# EAGLE design StickIt (EAGLE 5.11)
AUTHOR: Dave Vandenbout / XESS Corp.; COPYRIGHT: c 2012 XESS Corp.; DIGIKEY#: S5520-ND; MANF: Good Luck Buy; MANF#: 69481; MOUSER#: 653-B3F-1000; VERSION#: 3.0
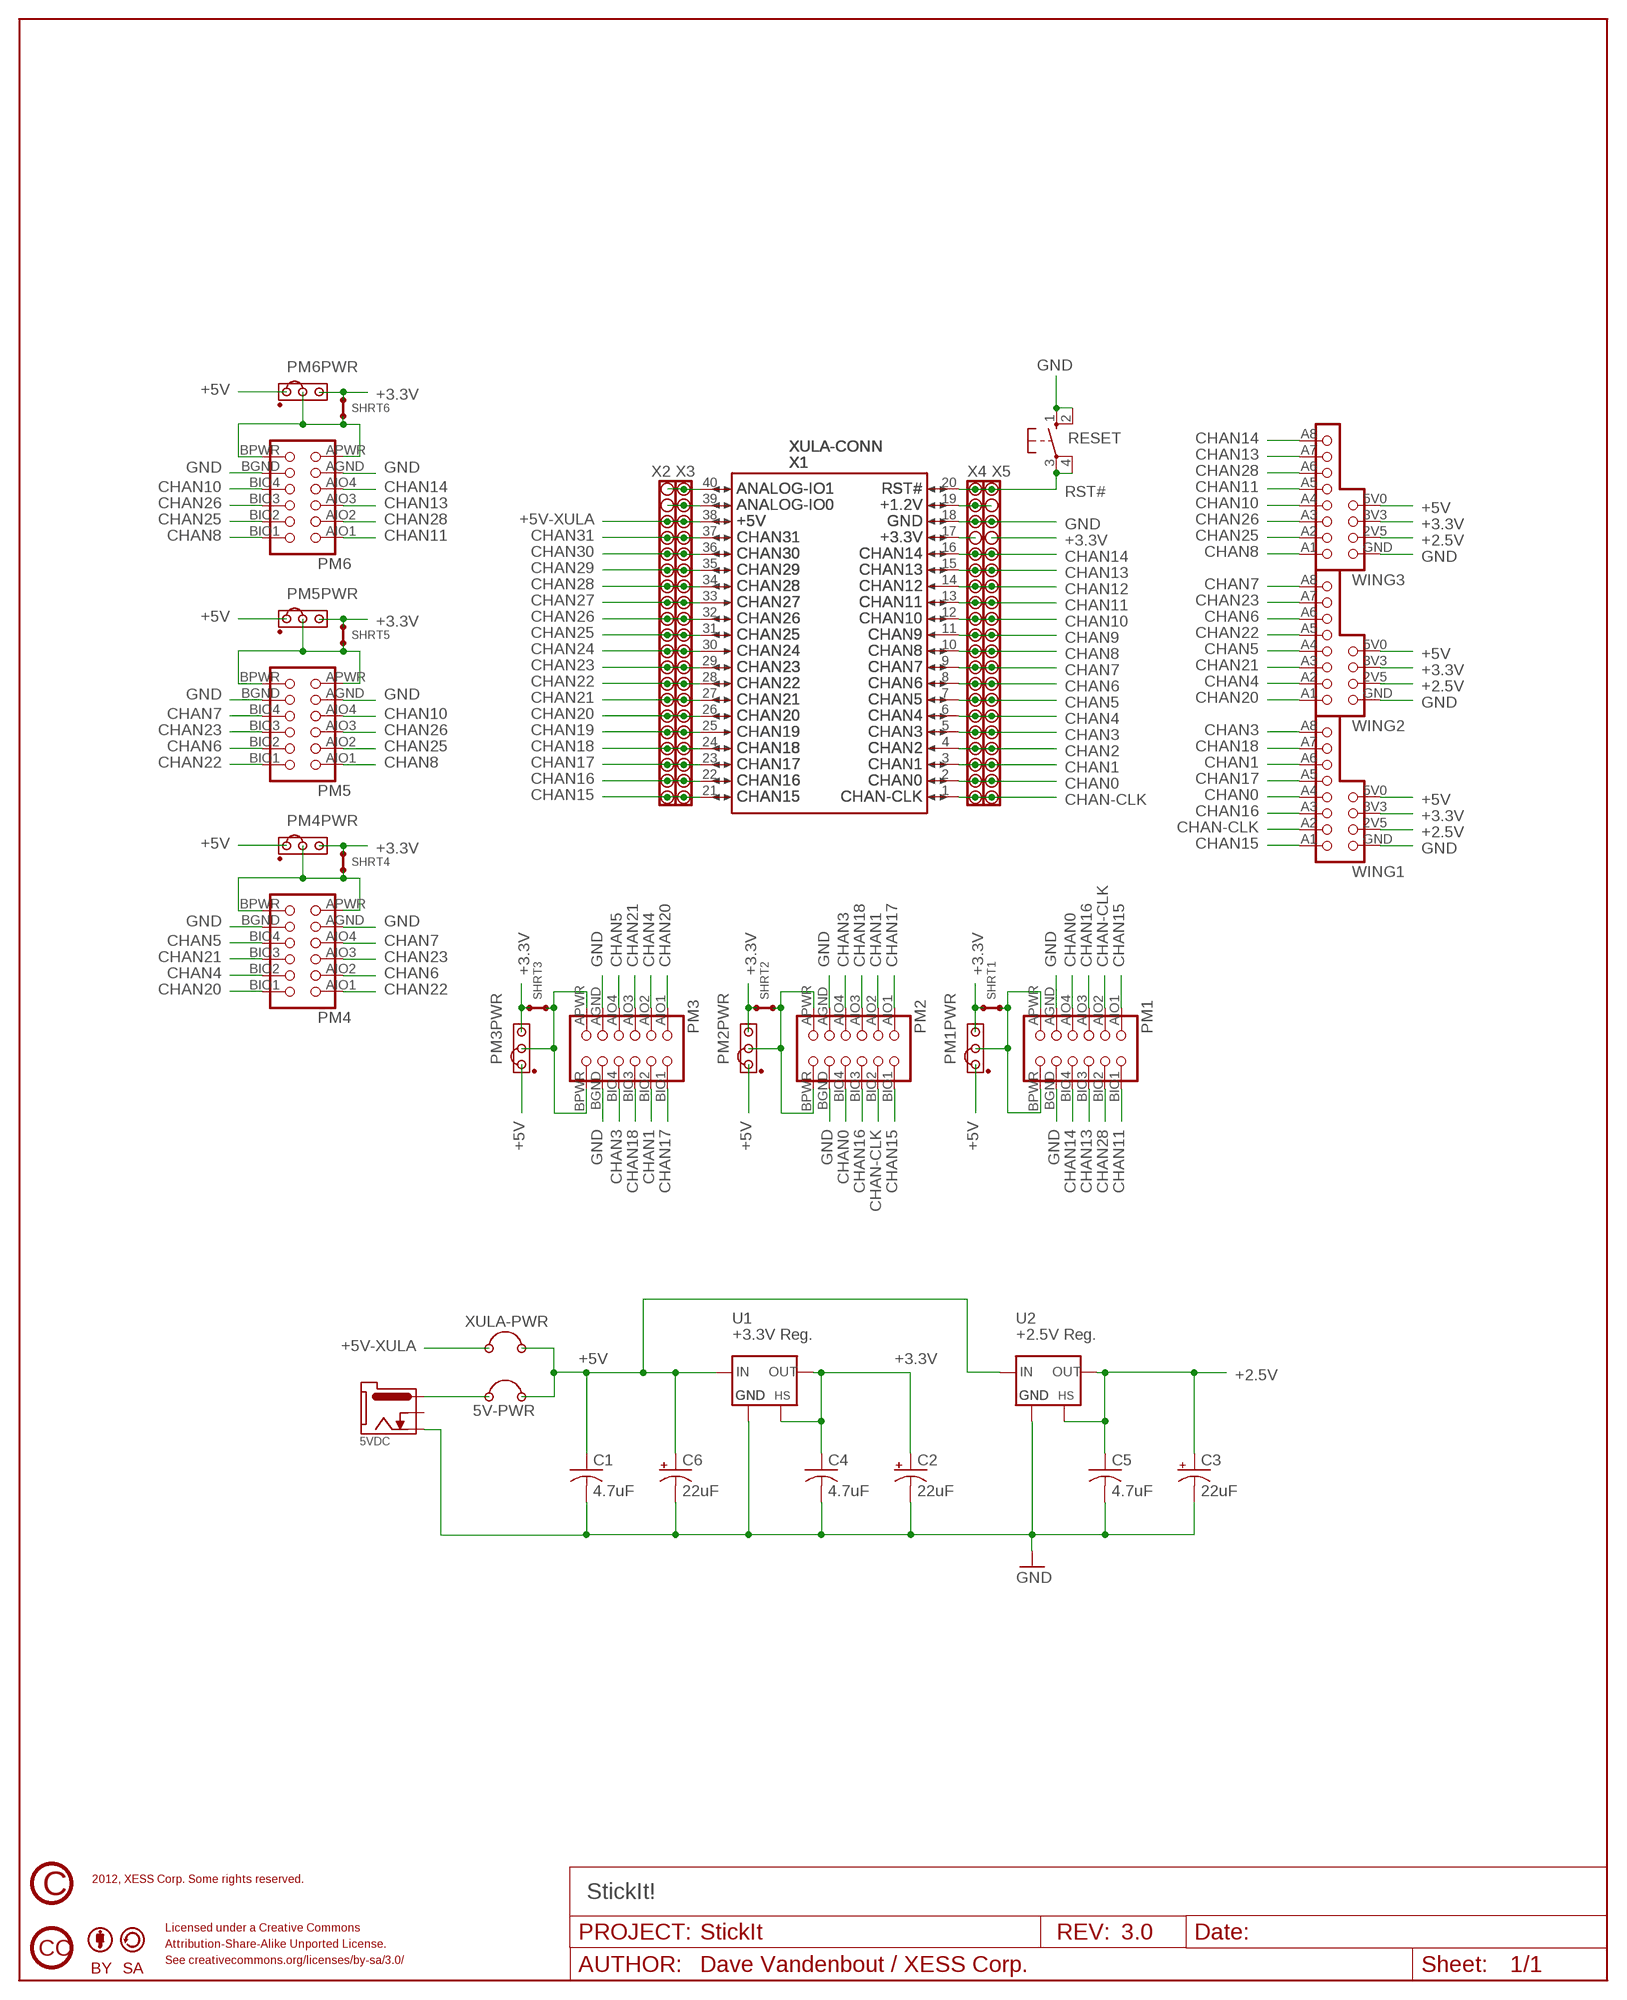
[diagram p0: schematic, sheet 1]

## Parts
5V-PWR  JP1Q"  [JP1]
5VDC  POWERJACKRIGHT_ANGLE  [PJ-202]
C1  4.7uF  C-USC0603  [C0603]
C2  22uF  CPOL-USC  [PANASONIC_C]
C3  22uF  CPOL-USC  [PANASONIC_C]
C4  4.7uF  C-USC0603  [C0603]
C5  4.7uF  C-USC0603  [C0603]
C6  22uF  CPOL-USC  [PANASONIC_C]
PM1  PMOD12SOCKET  [PMOD12-SOCKET]
PM1PWR  JP2E  [JP2]
PM2  PMOD12SOCKET  [PMOD12-SOCKET]
PM2PWR  JP2E  [JP2]
PM3  PMOD12SOCKET  [PMOD12-SOCKET]
PM3PWR  JP2E  [JP2]
PM4  PMOD12SOCKET  [PMOD12-SOCKET]
PM4PWR  JP2E  [JP2]
PM5  PMOD12SOCKET  [PMOD12-SOCKET]
PM5PWR  JP2E  [JP2]
PM6  PMOD12SOCKET  [PMOD12-SOCKET]
PM6PWR  JP2E  [JP2]
RESET  10-XX  [B3F-10XX]
SHRT1  JSHORTWIDE  [JPSHORTW]
SHRT2  JSHORTWIDE  [JPSHORTW]
SHRT3  JSHORTWIDE  [JPSHORTW]
SHRT4  JSHORTWIDE  [JPSHORTW]
SHRT5  JSHORTWIDE  [JPSHORTW]
SHRT6  JSHORTWIDE  [JPSHORTW]
U1  +3.3V Reg.  FAN1117  [SOT223]
U2  +2.5V Reg.  FAN1117  [SOT223]
U$2  CC_CC  [CC_CC]
U$3  CC_BY  [CC_BY]
U$4  CC_SA  [CC_SA]
U$5  CC_COPYRIGHT  [CC_COPYRIGHT]
WING1  PAPILIO_WING8SOCKET  [PAPILIO_WING8]
WING2  PAPILIO_WING8SOCKET  [PAPILIO_WING8]
WING3  PAPILIO_WING8SOCKET  [PAPILIO_WING8]
X1  XULA-CONN  [XULA-DIP40]
X2  PINHD-1X20A  [1X20]
X3  PINHD-1X20A  [1X20]
X4  PINHD-1X20A  [1X20]
X5  PINHD-1X20A  [1X20]
XULA-PWR  JP1Q"  [JP1]

## Nets
+2.5V: C3.+ C5.1 U2.2(OUT) U2.4(HS) WING1.2V5 WING2.2V5 WING3.2V5
+3.3V: C2.+ C4.1 PM1PWR.3 PM2PWR.3 PM3PWR.3 PM4PWR.3 PM5PWR.3 PM6PWR.3 SHRT1.2 SHRT2.2 SHRT3.2 SHRT4.2 SHRT5.2 SHRT6.2 U1.2(OUT) U1.4(HS) WING1.3V3 WING2.3V3 WING3.3V3 X5.4
+5V: 5V-PWR.2 C1.1 C6.+ PM1PWR.1 PM2PWR.1 PM3PWR.1 PM4PWR.1 PM5PWR.1 PM6PWR.1 U1.3(IN) U2.3(IN) WING1.5V0(5V) WING2.5V0(5V) WING3.5V0(5V) XULA-PWR.2
+5V-XULA: X1.38 X2.3 X3.3 XULA-PWR.1
CHAN0: PM1.AIO4 PM2.BIO4 WING1.A4 X1.2 X4.19 X5.19
CHAN1: PM2.AIO2 PM3.BIO2 WING1.A6 X1.3 X4.18 X5.18
CHAN2: X1.4 X4.17 X5.17
CHAN3: PM2.AIO4 PM3.BIO4 WING1.A8 X1.5 X4.16 X5.16
CHAN4: PM3.AIO2 PM4.BIO2 WING2.A2 X1.6 X4.15 X5.15
CHAN5: PM3.AIO4 PM4.BIO4 WING2.A4 X1.7 X4.14 X5.14
CHAN6: PM4.AIO2 PM5.BIO2 WING2.A6 X1.8 X4.13 X5.13
CHAN7: PM4.AIO4 PM5.BIO4 WING2.A8 X1.9 X4.12 X5.12
CHAN8: PM5.AIO1 PM6.BIO1 WING3.A1 X1.10 X4.11 X5.11
CHAN9: X1.11 X4.10 X5.10
CHAN10: PM5.AIO4 PM6.BIO4 WING3.A4 X1.12 X4.9 X5.9
CHAN11: PM1.BIO1 PM6.AIO1 WING3.A5 X1.13 X4.8 X5.8
CHAN12: X1.14 X4.7 X5.7
CHAN13: PM1.BIO3 PM6.AIO3 WING3.A7 X1.15 X4.6 X5.6
CHAN14: PM1.BIO4 PM6.AIO4 WING3.A8 X1.16 X4.5 X5.5
CHAN15: PM1.AIO1 PM2.BIO1 WING1.A1 X1.21 X2.20 X3.20
CHAN16: PM1.AIO3 PM2.BIO3 WING1.A3 X1.22 X2.19 X3.19
CHAN17: PM2.AIO1 PM3.BIO1 WING1.A5 X1.23 X2.18 X3.18
CHAN18: PM2.AIO3 PM3.BIO3 WING1.A7 X1.24 X2.17 X3.17
CHAN19: X1.25 X2.16 X3.16
CHAN20: PM3.AIO1 PM4.BIO1 WING2.A1 X1.26 X2.15 X3.15
CHAN21: PM3.AIO3 PM4.BIO3 WING2.A3 X1.27 X2.14 X3.14
CHAN22: PM4.AIO1 PM5.BIO1 WING2.A5 X1.28 X2.13 X3.13
CHAN23: PM4.AIO3 PM5.BIO3 WING2.A7 X1.29 X2.12 X3.12
CHAN24: X1.30 X2.11 X3.11
CHAN25: PM5.AIO2 PM6.BIO2 WING3.A2 X1.31 X2.10 X3.10
CHAN26: PM5.AIO3 PM6.BIO3 WING3.A3 X1.32 X2.9 X3.9
CHAN27: X1.33 X2.8 X3.8
CHAN28: PM1.BIO2 PM6.AIO2 WING3.A6 X1.34 X2.7 X3.7
CHAN29: X1.35 X2.6 X3.6
CHAN30: X1.36 X2.5 X3.5
CHAN31: X1.37 X2.4 X3.4
CHAN-CLK: PM1.AIO2 PM2.BIO2 WING1.A2 X1.1 X4.20 X5.20
GND: 5VDC.2 C1.2 C2.- C3.- C4.2 C5.2 C6.- PM1.AGND PM1.BGND PM2.AGND PM2.BGND PM3.AGND PM3.BGND PM4.AGND PM4.BGND PM5.AGND PM5.BGND PM6.AGND PM6.BGND RESET.1(S) RESET.2(S1) U1.1(GND) U2.1(GND) WING1.GND WING2.GND WING3.GND X1.18 X4.3 X5.3
N$1: 5V-PWR.1 5VDC.1
N$3: PM1.APWR PM1.BPWR PM1PWR.2 SHRT1.1
N$4: PM2.APWR PM2.BPWR PM2PWR.2 SHRT2.1
N$5: PM3.APWR PM3.BPWR PM3PWR.2 SHRT3.1
N$6: PM4.APWR PM4.BPWR PM4PWR.2 SHRT4.1
N$7: PM5.APWR PM5.BPWR PM5PWR.2 SHRT5.1
N$8: PM6.APWR PM6.BPWR PM6PWR.2 SHRT6.1
N$9: X1.17 X4.4
N$10: X1.19 X4.2 X5.2
N$11: X1.39 X2.2 X3.2
N$12: X1.40 X2.1 X3.1
RST#: RESET.3(P) RESET.4(P1) X1.20 X4.1 X5.1
Unconnected: 5VDC.3

## Notes on the sheet
- 2012, XESS Corp. Some rights reserved.
- StickIt!
- Licensed under a Creative Commons
- Attribution-Share-Alike Unported License.
- See creativecommons.org/licenses/by-sa/3.0/

## Library data of the parts
5V-PWR XULA-PWR = xess:JP1Q: JUMPER
5VDC = xess:POWERJACK: 2.1mm AC Adapter Power Jack
C1 C4 C5 = rcl:C-US: CAPACITOR, American symbol
C2 C3 C6 = rcl:CPOL-US: POLARIZED CAPACITOR, American symbol
PM1-PM6 = xess:PMOD12: 12-Pin PMOD Socket/Header 8 data I/O pins, 2 GND, 2 PWR.; DIGIKEY#: S5520-ND; MANF: Ho Chien; MANF#: 2553-2X6G
PM1PWR PM2PWR PM3PWR PM4PWR PM5PWR PM6PWR = xess:JP2E: JUMPER
RESET = xess:10-XX: OMRON SWITCH; DIGIKEY#: SW400-ND; MANF: Omron Electronics; MANF#: B3F-1000; MOUSER#: 653-B3F-1000
SHRT1-SHRT6 = xess:JSHORT: Bridge
U1 U2 = xess:FAN1117: +3.3V Linear Regulator
U$2 = xess:CC_CC
U$3 = xess:CC_BY
U$4 = xess:CC_SA
U$5 = xess:CC_COPYRIGHT
WING1-WING3 = xess:PAPILIO_WING8: PIN HEADER
X1 = xess:XULA-CONN: XuLA Board Connector
X2-X5 = pinhead:PINHD-1X20A: PIN HEADER

## Net classes
1 power: clearance 0.254 mm

## Board
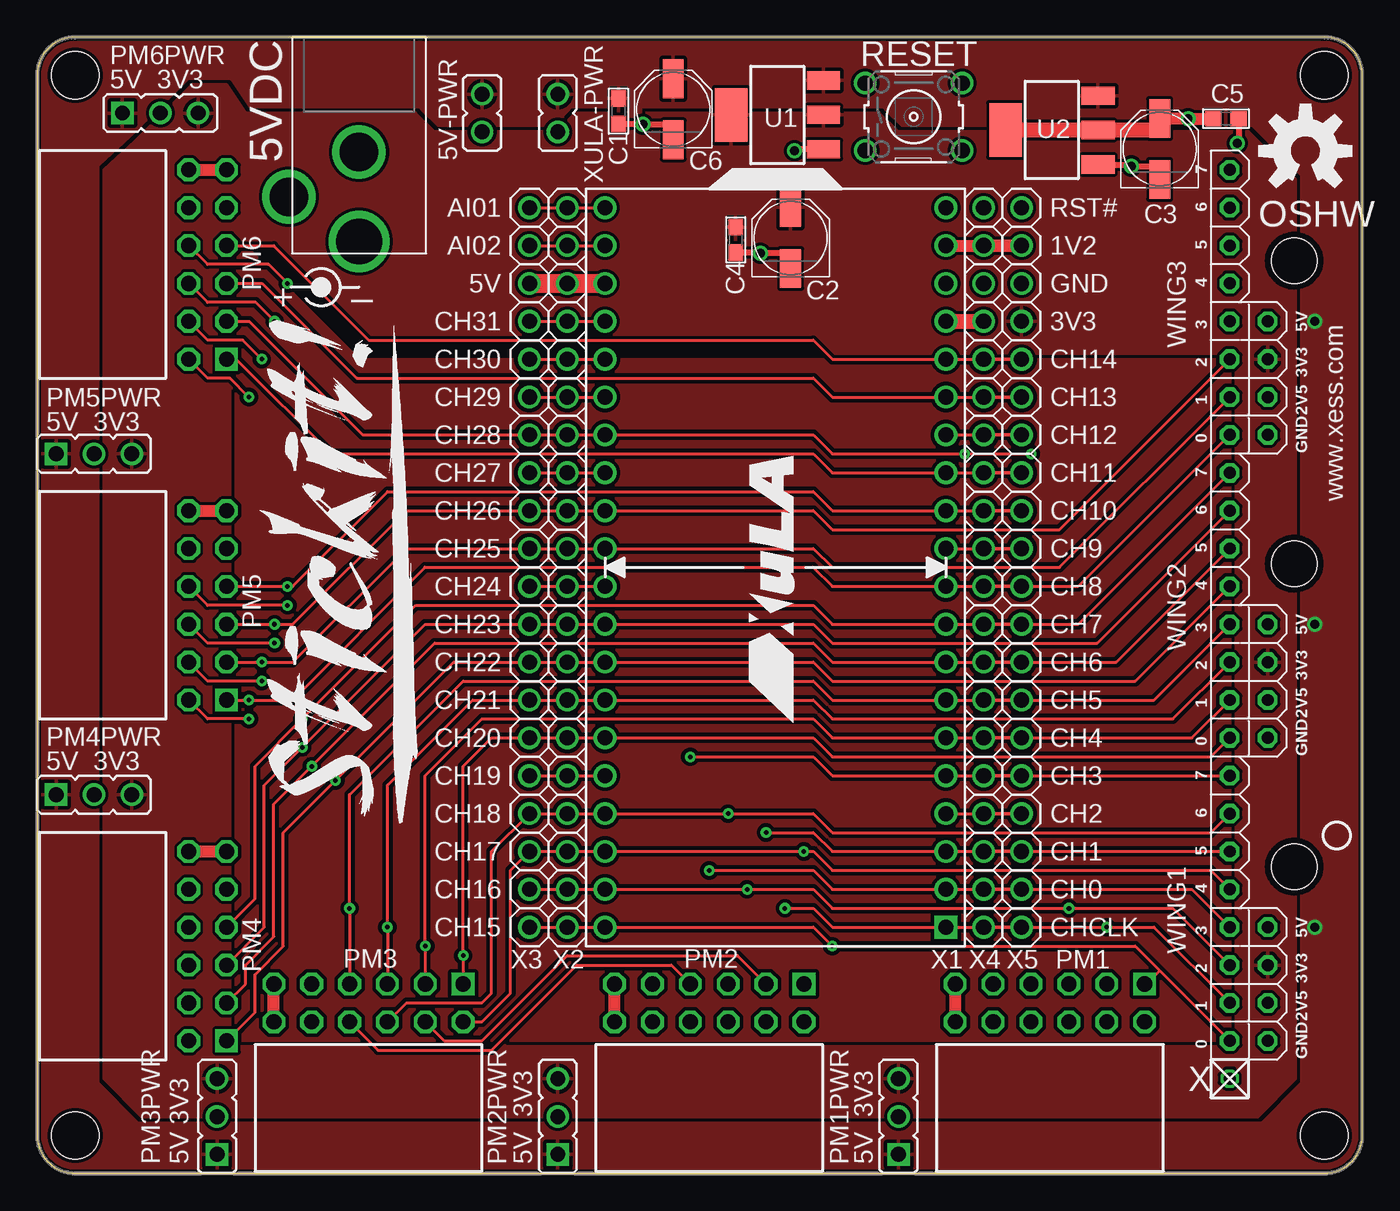
[diagram p1: board, top side]
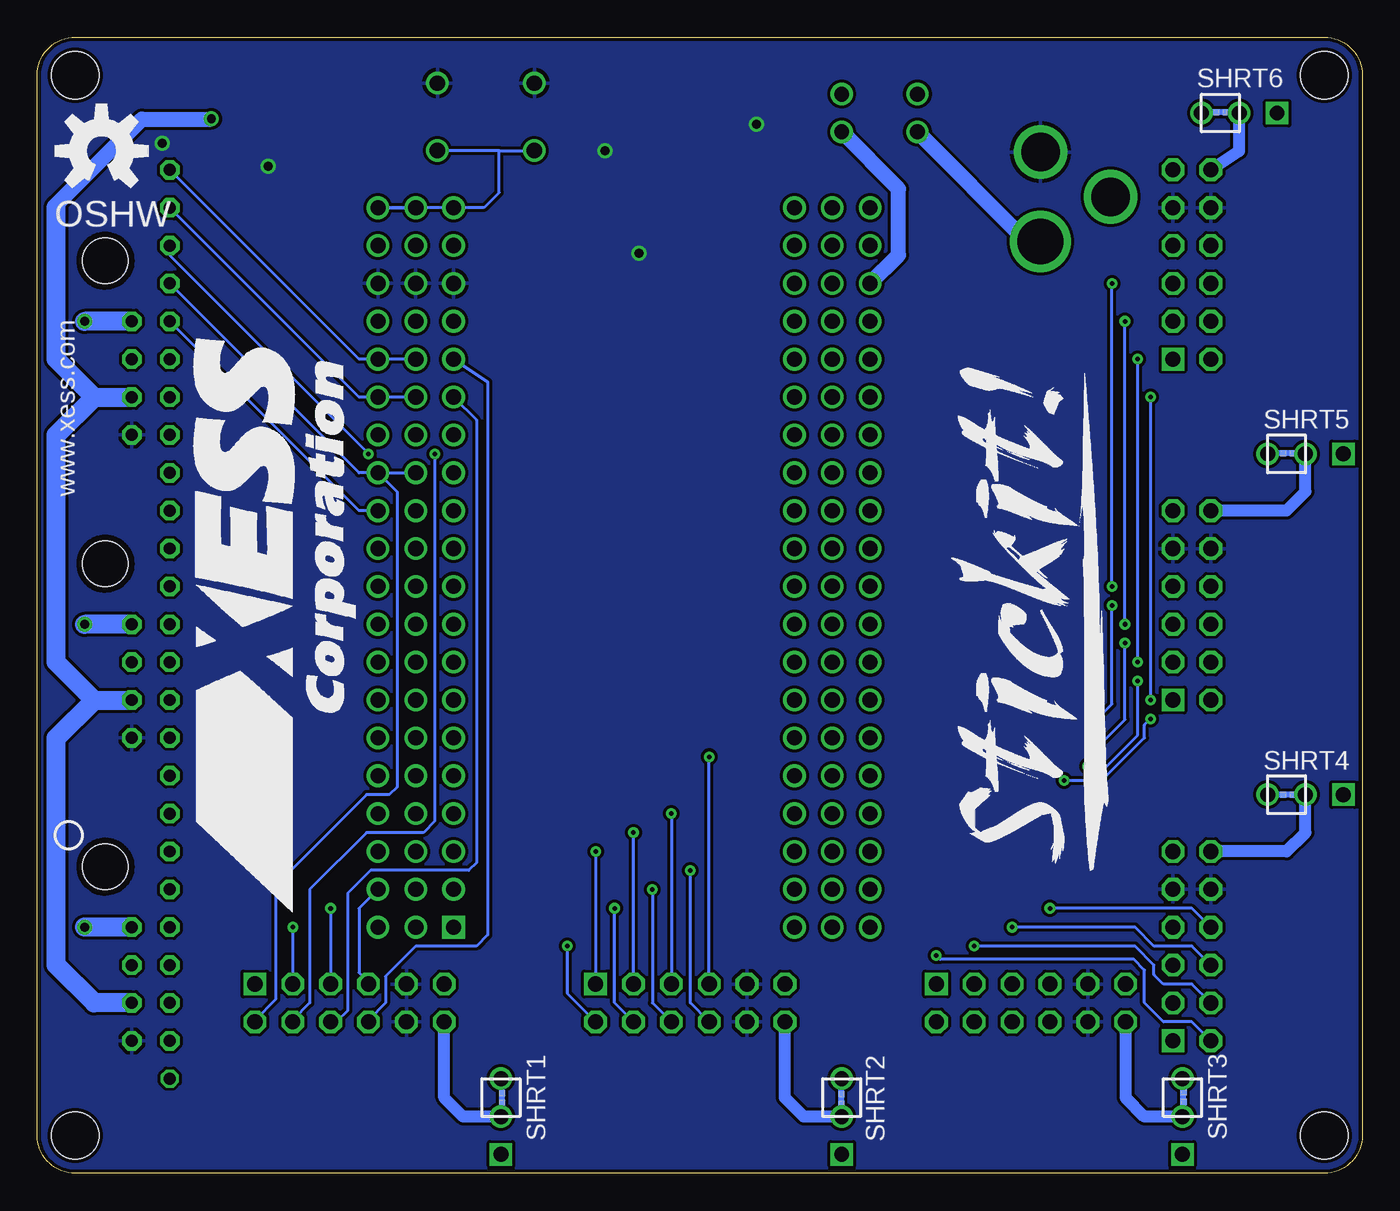
[diagram p2: board, bottom side, seen from below]

Size 88.9 x 76.2 mm. Coordinates in mm from the lower left corner, seen from the top.
Outline: 0,73.66 0,2.54 arc90 2.54,0 86.36,0 arc90 88.9,2.54 88.9,73.66 arc90 86.36,76.2 2.54,76.2 arc90 0,73.66
Copper layers (1*16): Top 0.035mm / dielectric 1.5mm / Bottom 0.035mm
Design rules "ITeadstudio_safe *": minimum track width 8mil, minimum drill 12mil, track to track 8mil, track to pad 8mil, pad to pad 8mil, via to via 8mil, smd to smd 0mil, copper to edge 10mil, drill to drill 10mil, minimum pad ring 10mil, minimum via ring 8mil, stop-mask expansion 2mil, vias tented up to drill 30mil, thermal gap 10mil
Holes 3.17 mm at 2.54,73.66 86.36,73.66 86.36,2.54 2.54,2.54

### Footprints (pad centres in the part's own frame; a part is rotated, then mirrored left to right if it is on the bottom)
JP1 = drill 1 round: 1 0,-1.27; 2 0,1.27
PJ-202 = drill 3.08 round: 1 13.7,0 | drill 2.58 round: 2 7.7,0; 3 10.7,-4.7
C0603 = smd 1.1 x 1: 1 -0.85,0; 2 0.85,0
PANASONIC_C = smd 2.6 x 1.4: + 2.05,0; - -2.05,0
PMOD12-SOCKET = drill 1.016 octagon: AGND 3.81,-1.27; AIO2 -3.81,-1.27; AIO3 -1.27,-1.27; AIO4 1.27,-1.27; APWR 6.35,-1.27; BGND 3.81,1.27; BIO1 -6.35,1.27; BIO2 -3.81,1.27; BIO3 -1.27,1.27; BIO4 1.27,1.27; BPWR 6.35,1.27 | drill 1.016 square: AIO1 -6.35,-1.27
JP2 = drill 1 square: 1 -2.54,0 | drill 1 round: 2 0,0; 3 2.54,0
B3F-10XX = drill 1.016 round: 1 -3.251,2.261; 2 3.251,2.261; 3 -3.251,-2.261; 4 3.251,-2.261
JPSHORTW = smd 0.406 x 0.406: 1 0,0; 2 0.635,0
SOT223 = smd 1.219 x 2.235: 1 -2.311,-3.099; 2 0,-3.099; 3 2.311,-3.099 | smd 3.6 x 2.2: 4 0,3.099
PAPILIO_WING8 = drill 0.8 octagon: 2V5 -2.54,-2.54; 3V3 -2.54,-5.08; 5V0 -2.54,-7.62; A1 0,0; A2 0,-2.54; A3 0,-5.08; A4 0,-7.62; A5 0,-10.16; A6 0,-12.7; A7 0,-15.24; A8 0,-17.78; GND -2.54,0 | hole 3.048: -4.318,-11.684
XULA-DIP40 = drill 1.016 square: 1 49.53,24.13 | drill 1.016 round: 2 46.99,24.13; 3 44.45,24.13; 4 41.91,24.13; 5 39.37,24.13; 6 36.83,24.13; 7 34.29,24.13; 8 31.75,24.13; 9 29.21,24.13; 10 26.67,24.13; 11 24.13,24.13; 12 21.59,24.13; 13 19.05,24.13; 14 16.51,24.13; 15 13.97,24.13; 16 11.43,24.13; 17 8.89,24.13; 18 6.35,24.13; 19 3.81,24.13; 20 1.27,24.13; 21 49.53,1.27; 22 46.99,1.27; 23 44.45,1.27; 24 41.91,1.27; 25 39.37,1.27; 26 36.83,1.27; 27 34.29,1.27; 28 31.75,1.27; 29 29.21,1.27; 30 26.67,1.27; 31 24.13,1.27; 32 21.59,1.27; 33 19.05,1.27; 34 16.51,1.27; 35 13.97,1.27; 36 11.43,1.27; 37 8.89,1.27; 38 6.35,1.27; 39 3.81,1.27; 40 1.27,1.27
1X20 = drill 1.016 round: 1 -24.13,0; 2 -21.59,0; 3 -19.05,0; 4 -16.51,0; 5 -13.97,0; 6 -11.43,0; 7 -8.89,0; 8 -6.35,0; 9 -3.81,0; 10 -1.27,0; 11 1.27,0; 12 3.81,0; 13 6.35,0; 14 8.89,0; 15 11.43,0; 16 13.97,0; 17 16.51,0; 18 19.05,0; 19 21.59,0; 20 24.13,0

### Placement (x,y rotation side)
5V-PWR  29.84,71.12 0 top
5VDC  21.59,76.2 270 top
C1  38.99,71.25 270 top
C2  50.55,62.74 90 top
C3  75.31,68.71 90 top
C4  46.86,62.61 270 top
C5  79.76,70.74 0 top
C6  42.67,71.37 90 top
PM1  67.94,11.43 180 top
PM1PWR  57.78,3.81 90 top
PM2  45.09,11.43 180 top
PM2PWR  34.92,3.81 90 top
PM3  22.23,11.43 180 top
PM3PWR  12.06,3.81 90 top
PM4  11.43,15.24 90 top
PM4PWR  3.81,25.4 0 top
PM5  11.43,38.1 90 top
PM5PWR  3.81,48.26 0 top
PM6  11.43,60.96 90 top
PM6PWR  8.26,71.12 0 top
RESET  58.8,70.87 0 top
SHRT1  57.71,4.72 90 bottom
SHRT2  34.95,4.67 90 bottom
SHRT3  11.99,4.8 90 bottom
SHRT4  4.67,25.4 180 bottom
SHRT5  4.67,48.29 180 bottom
SHRT6  9.14,71.17 180 bottom
U1  49.66,70.99 90 top
U2  68.07,69.98 90 top
U$2  15.24,-15.88 0 top  (outside the outline)
U$3  22.23,-14.61 0 top  (outside the outline)
U$4  27.3,-14.61 0 top  (outside the outline)
U$5  15.24,-6.99 0 top  (outside the outline)
WING1  80.01,8.89 180 top
WING2  80.01,29.21 180 top
WING3  80.01,49.53 180 top
X1  36.83,66.04 270 top
X2  35.56,40.64 270 top
X3  33.02,40.64 270 top
X4  63.5,40.64 270 top
X5  66.04,40.64 270 top
XULA-PWR  34.92,71.12 0 top

### Tracks (layer width: path | path; a pad name or v marks a point on that pad's centre or on a via)
+2.5V  (via drill 0.6)
  Top 0.406: 75.31,70.74 C3.+
  Top 0.813: 75.31,70.74 v77.22,70.74 C5.1
  Top 1.016: U2.4 U2.2 75.18,69.98 75.18,70.1 75.31,70.1 C3.+
  Bottom 0.813: 87.63,64.77 87.63,64.97 | 77.24,70.71 v77.22,70.74
  Bottom 1.016: 87.63,64.97 81.89,70.71 77.24,70.71
  Bottom 1.27: WING1.2V5 85.09,11.43 87.63,13.97 87.63,29.21 85.09,31.75 | 85.09,31.75 WING2.2V5 | 85.09,31.75 87.63,34.29 87.63,49.53 85.09,52.07 | 85.09,52.07 WING3.2V5 | 87.63,64.77 87.63,54.61 85.09,52.07
+3.3V
  Bottom 0.406: SHRT1.2 57.71,6.27 PM1PWR.3 | SHRT2.2 34.95,6.33 PM2PWR.3 | SHRT3.2 11.99,6.27 PM3PWR.3 | SHRT4.2 PM4PWR.3 | SHRT5.2 6.33,48.28 PM5PWR.3 | SHRT6.2 10.74,71.17 PM6PWR.3
  pour Top (rank 2): 6.99,3.81 78.11,3.81 81.28,3.81 81.92,3.81 84.45,6.35 84.45,66.67 81.28,69.85 57.78,69.85 56.52,71.12 36.07,71.12 34.8,69.85 26.67,69.85 25.4,71.12 13.97,71.12 12.7,73.03 10.36,73.03 6.55,69.22 4.45,67.31 4.45,6.35
+5V  (via drill 0.6)
  Bottom 1.27: WING3.5V0 v85.72,57.15 | WING2.5V0 v85.72,36.83 | WING1.5V0 v85.72,16.51
  pour Top (rank 3): 0,76.2 88.9,76.2 88.9,0 0,0
  pour Top (isolate 0.254, no thermals): 13.34,8.89 13.34,62.23 13.97,62.23 21.59,54.61 80.01,54.61 80.01,8.89
+5V-XULA
  Top 1.27: X1.38 X2.3 X3.3
  Bottom 1.016: X3.3 31.11,61.59 31.11,66.04 XULA-PWR.1
CHAN0  (via drill 0.3)
  Top 0.203: v45.09,20.32 52.07,20.32 53.34,19.05 X1.2 X5.19 X4.19 77.47,19.05 WING1.A4
  Bottom 0.203: PM2.BIO4 45.09,11.43 v45.09,20.32 | PM1.AIO4 66.67,12.83 67.31,13.46 67.31,17.78 X5.19
CHAN1  (via drill 0.3)
  Top 0.203: v48.9,22.86 52.07,22.86 53.34,21.59 X1.3 X5.18 X4.18 WING1.A6 | PM3.BIO2 27.3,8.89 29.84,8.89 35.56,14.61 46.99,14.61 PM2.AIO2
  Bottom 0.203: PM2.AIO2 v48.9,22.86
CHAN2
  Top 0.203: X1.4 X5.17 X4.17
CHAN3  (via drill 0.3)
  Top 0.203: v43.81,27.94 52.07,27.94 53.34,26.67 X1.5 X5.16 X4.16 WING1.A8 | PM3.BIO4 22.86,8.26 30.48,8.26 36.2,13.97 42.55,13.97 PM2.AIO4
  Bottom 0.203: PM2.AIO4 v43.81,27.94
CHAN4  (via drill 0.3)
  Top 0.203: PM3.AIO2 v26.04,15.24 26.04,26.67 29.84,30.48 52.07,30.48 53.34,29.21 X1.6 X5.15 X4.15 77.47,29.21 WING2.A2
  Bottom 0.203: PM4.BIO2 11.43,12.7 13.34,12.7 13.97,13.34 13.97,13.97 15.24,15.24 v26.04,15.24
CHAN5  (via drill 0.3)
  Top 0.203: PM3.AIO4 v20.95,17.78 20.95,25.4 28.57,33.02 52.07,33.02 53.34,31.75 X1.7 X5.14 X4.14 74.93,31.75 WING2.A4
  Bottom 0.203: PM4.BIO4 11.43,17.78 v20.95,17.78
CHAN6  (via drill 0.3)
  Top 0.203: v15.06,33.02 11.43,33.02 PM5.BIO2 | WING2.A6 72.39,34.29 X4.13 X5.13 X1.8 53.34,34.29 52.07,35.56 26.67,35.56 v18.41,27.3 15.88,24.77 15.88,15.88 13.97,13.97 13.97,12.7 PM4.AIO2
  Bottom 0.203: v15.06,33.02 15.06,29.39 17.14,27.3 v18.41,27.3
CHAN7  (via drill 0.3)
  Top 0.203: v16.79,38.1 11.43,38.1 PM5.BIO4 | WING2.A8 69.85,36.83 X4.12 X5.12 X1.9 53.34,36.83 52.07,38.1 25.4,38.1 v17.78,30.48 14.61,27.3 14.61,18.41 PM4.AIO4
  Bottom 0.203: v16.79,38.1 16.79,31.47 v17.78,30.48
CHAN8  (via drill 0.3)
  Top 0.203: PM5.AIO1 v14.2,31.75 17.14,31.75 26.01,40.66 52.05,40.66 53.34,39.37 X1.10 X5.11 X4.11 69.85,39.37 WING3.A1 | v14.2,52.07 12.93,53.34 11.43,53.34 PM6.BIO1
  Bottom 0.203: v14.2,31.75 v14.2,52.07
CHAN9
  Top 0.203: X1.11 X5.10 X4.10
CHAN10  (via drill 0.3)
  Top 0.203: PM5.AIO4 v16.79,39.37 17.14,39.37 23.5,45.72 52.07,45.72 53.34,44.45 X1.12 X5.9 X4.9 | v16.79,59.69 15.52,60.96 11.43,60.96 PM6.BIO4
  Bottom 0.203: v16.79,39.37 v16.79,59.69 | WING3.A4 67.31,44.45 X5.9
CHAN11
  Top 0.203: PM6.AIO1 13.36,54.61 19.71,48.26 52.07,48.26 53.34,46.99 X1.13 X5.8 X4.8
  Bottom 0.203: WING3.A5 67.31,46.99 X5.8 | X5.8 X4.8 | PM1.BIO1 74.3,10.29 72.9,11.68 72.9,19.3 66.8,25.4 65.28,25.4 64.77,25.91 64.77,45.72 X5.8
CHAN12
  Top 0.203: X1.14 X5.7 X4.7
CHAN13
  Top 0.203: X4.6 X5.6 X1.15 53.34,52.07 52.07,53.34 21.44,53.34 15.09,59.69 PM6.AIO3
  Bottom 0.203: WING3.A7 67.31,52.07 X4.6 | X1.15 59.44,50.55 59.44,20.83 59.94,20.32 66.55,20.32 68.07,18.8 68.07,10.92 68.83,10.16 PM1.BIO3
CHAN14
  Top 0.203: X4.5 X5.5 X1.16 53.34,54.61 52.07,55.88 22.23,55.88 15.88,62.23 PM6.AIO4
  Bottom 0.203: WING3.A8 67.31,54.61 X4.5 | PM1.BIO4 66.67,10.29 65.53,11.43 65.53,13.21 63.5,15.24 59.44,15.24 58.67,16 58.67,53.09 X1.16
CHAN15  (via drill 0.3)
  Top 0.203: X3.20 X2.20 X1.21 52.07,16.51 v53.34,15.24 73.66,15.24 75.31,13.59 | 75.31,13.59 WING1.A1 | PM1.AIO1 74.42,12.7 75.31,13.59
  Bottom 0.203: PM2.BIO1 53.34,12.06 v53.34,15.24
CHAN16  (via drill 0.3)
  Top 0.203: WING1.A3 76.2,17.78 v69.22,17.78 53.34,17.78 52.07,19.05 v47.62,19.05 X1.22 X2.19 X3.19
  Bottom 0.203: PM2.BIO3 47.62,11.43 v47.62,19.05 | v69.22,17.78 PM1.AIO3
CHAN17  (via drill 0.3)
  Top 0.203: WING1.A5 78.74,20.32 53.34,20.32 52.07,21.59 v51.44,21.59 X1.23 X2.18 X3.18 31.75,20.32 31.75,12.06 29.84,10.16 PM3.BIO1
  Bottom 0.203: v51.44,21.59 PM2.AIO1
CHAN18  (via drill 0.3)
  Top 0.203: WING1.A7 78.74,22.86 53.34,22.86 52.07,24.13 v46.35,24.13 X1.24 X2.17 X3.17 30.48,21.59 30.48,12.06 29.84,11.43 24.77,11.43 PM3.BIO3
  Bottom 0.203: v46.35,24.13 PM2.AIO3
CHAN19
  Top 0.203: X1.25 X2.16 X3.16
CHAN20  (via drill 0.3)
  Top 0.203: PM3.AIO1 v28.57,14.61 28.57,27.3 30.48,29.21 X3.15 X2.15 X1.26 52.07,29.21 53.34,27.94 78.74,27.94 WING2.A1
  Bottom 0.203: PM4.BIO1 11.43,10.16 13.34,10.16 14.61,11.43 14.61,13.64 15.32,14.35 28.32,14.35 v28.57,14.61
CHAN21  (via drill 0.3)
  Top 0.203: PM3.AIO3 v23.5,16.51 23.5,26.04 29.21,31.75 X3.14 X2.14 X1.27 52.07,31.75 53.34,30.48 76.2,30.48 WING2.A3
  Bottom 0.203: PM4.BIO3 11.43,15.24 13.97,15.24 15.24,16.51 v23.5,16.51
CHAN22  (via drill 0.3)
  Top 0.203: v14.2,30.48 11.43,30.48 PM5.BIO1 | WING2.A5 73.66,33.02 53.34,33.02 52.07,34.29 X1.28 X2.13 X3.13 27.94,34.29 v20,26.35 16.51,22.86 16.51,15.24 14.61,13.34 14.61,10.79 PM4.AIO1
  Bottom 0.203: v20,26.35 17.46,26.35 14.61,29.21 14.61,30.07 v14.2,30.48
CHAN23  (via drill 0.3)
  Top 0.203: v15.93,35.56 11.43,35.56 PM5.BIO3 | PM4.AIO3 15.24,16.51 15.24,26.04 v17.78,28.57 26.04,36.83 X3.12 X2.12 X1.29 52.07,36.83 53.34,35.56 71.12,35.56 WING2.A7
  Bottom 0.203: v15.93,35.56 15.93,30.43 v17.78,28.57
CHAN24
  Top 0.203: X3.11 X2.11 X1.30
CHAN25  (via drill 0.3)
  Top 0.203: PM5.AIO2 v15.06,34.29 17.14,34.29 24.77,41.91 X3.10 X2.10 X1.31 52.07,41.91 53.34,40.64 68.58,40.64 WING3.A2 | v15.06,54.61 13.79,55.88 11.43,55.88 PM6.BIO2
  Bottom 0.203: v15.06,34.29 v15.06,54.61
CHAN26  (via drill 0.3)
  Top 0.203: PM5.AIO3 v15.93,36.83 17.14,36.83 24.77,44.45 X3.9 X2.9 X1.32 52.07,44.45 53.34,43.18 68.58,43.18 WING3.A3 | v15.93,57.15 14.66,58.42 11.43,58.42 PM6.BIO3
  Bottom 0.203: v15.93,36.83 v15.93,57.15
CHAN27
  Top 0.203: X1.33 X2.8 X3.8
CHAN28  (via drill 0.3)
  Top 0.203: PM6.AIO2 14.22,57.15 21.84,49.53 X3.7 X2.7 X1.34 52.07,49.53 53.34,48.26 v62.23,48.26 v66.67,48.26
  Bottom 0.203: v66.67,48.26 80.01,61.59 WING3.A6 | PM1.BIO2 71.75,10.29 70.61,11.43 70.61,19.05 66.8,22.86 62.99,22.86 62.23,23.62 v62.23,48.26
CHAN29
  Top 0.203: X1.35 X2.6 X3.6
CHAN30
  Top 0.203: X3.5 X2.5 X1.36
CHAN31
  Top 0.203: X1.37 X2.4 X3.4
CHAN-CLK  (via drill 0.3)
  Top 0.203: WING1.A2 74.93,16.51 v71.75,16.51 X4.20 X5.20 X1.1 53.34,16.51 52.07,17.78 v50.16,17.78
  Bottom 0.203: v50.16,17.78 50.16,11.43 PM2.BIO2 | v71.75,16.51 PM1.AIO2
GND  (via drill 0.6)
  Top 0.406: C1.2 40.6,70.4 v40.64,70.36 42.42,70.36 42.67,70.1 C6.- | C4.2 48.48,61.76 v48.51,61.72 50.29,61.72 50.55,61.47 C2.- | U1.1 50.9,68.68 v50.8,68.58 | U2.1 73.3,67.67 v73.41,67.56 75.18,67.56 75.18,66.78 C3.- | C5.2 80.61,69.18 v80.52,69.09
  pour Bottom: 0,76.2 88.9,76.2 88.9,0 0,0
N$1
  Bottom 1.016: 5VDC.1 22.5,62.5 5V-PWR.1
N$2  (via drill 0.8)
  other vias: 80.01,6.35
N$3
  Top 0.813: PM1.BPWR PM1.APWR
  Bottom 0.406: SHRT1.1 57.71,3.89 PM1PWR.2
  Bottom 0.813: PM1PWR.2 60.33,3.81 61.59,5.08 PM1.BPWR
N$4
  Top 0.813: PM2.BPWR PM2.APWR
  Bottom 0.406: SHRT2.1 34.95,3.83 PM2PWR.2
  Bottom 0.813: PM2PWR.2 37.47,3.81 38.73,5.08 PM2.BPWR
N$5
  Top 0.813: PM3.BPWR PM3.APWR
  Bottom 0.406: SHRT3.1 11.99,3.89 PM3PWR.2
  Bottom 0.813: PM3PWR.2 14.61,3.81 15.88,5.08 PM3.BPWR
N$6
  Top 0.813: PM4.BPWR PM4.APWR
  Bottom 0.406: PM4PWR.2 SHRT4.1
  Bottom 0.813: PM4PWR.2 3.81,22.86 5.08,21.59 PM4.BPWR
N$7
  Top 0.813: PM5.BPWR PM5.APWR
  Bottom 0.406: SHRT5.1 3.83,48.28 PM5PWR.2
  Bottom 0.813: PM5PWR.2 3.81,45.72 5.08,44.45 PM5.BPWR
N$8
  Top 0.813: PM6.BPWR PM6.APWR
  Bottom 0.406: SHRT6.1 8.31,71.17 PM6PWR.2
  Bottom 0.813: PM6PWR.2 8.26,68.58 PM6.BPWR
N$9
  Top 1.016: X1.17 X4.4
N$10
  Top 0.813: X1.19 X5.2 X4.2
N$11
  Top 0.203: X3.2 X2.2 X1.39
N$12
  Top 0.203: X1.40 X2.1 X3.1
RST#
  Bottom 0.203: X4.1 X5.1 X1.20 58.93,64.77 57.91,65.79 57.91,68.61 | 57.91,68.61 RESET.3 | 57.91,68.61 RESET.4

### Text on the board
tPlace: 5V 3V3 | AI01 | RST# | OSHW | AI02 | 1V2 | 5V | _ | GND | + | CH31 | 3V3 | CH30 | CH14 | CH29 | CH13 | 5V 3V3 | CH28 | CH12 | CH27 | CH11 | CH26 | www.xess.com | CH10 | CH25 | CH9 | CH24 | CH8 | CH23 | CH7 | CH22 | CH6 | CH21 | CH5 | CH20 | CH4 | 5V 3V3 | CH19 | CH3 | CH18 | CH2 | CH17 | CH1 | CH16 | CH0 | CH15 | CHCLK | X | 5V 3V3 | 5V 3V3 | 5V 3V3
bPlace: OSHW | www.xess.com
tDocu: +5V/3.3V | CHAN14 | GND | +5V/3.3V | GND | CHAN13 | CHAN10 | CHAN28 | CHAN14 | CHAN26 | CHAN11 | CHAN13 | CHAN25 | CHAN10 | CHAN28 | +5.0V | CHAN8 | CHAN26 | CHAN11 | +3.3V | CHAN25 | +2.5V | CHAN8 | GND | CHAN7 | +5V/3.3V | CHAN23 | +5V/3.3V | GND | CHAN6 | GND | CHAN7 | CHAN22 | CHAN10 | CHAN23 | CHAN5 | CHAN26 | +5.0V | CHAN6 | CHAN21 | CHAN25 | +3.3V | CHAN22 | CHAN4 | CHAN8 | +2.5V | CHAN20 | GND | CHAN3 | CHAN18 | +5V/3.3V | CHAN1 | +5V/3.3V | GND | CHAN17 | GND | CHAN5 | CHAN0 | CHAN7 | +5.0V | CHAN21 | CHAN16 | CHAN23 | CHAN5 | CHAN21 | CHAN4 | CHAN20 | GND | CHAN3 | CHAN18 | CHAN1 | CHAN17 | +5V/3.3V | +3.3V | CHAN4 | CHAN-CLK | +2.5V | CHAN20 | CHAN6 | CHAN-CLK | CHAN3 | CHAN18 | CHAN1 | CHAN17 | +5V/3.3V | GND | CHAN0 | CHAN16 | CHAN15 | +5V/3.3V | GND | GND | CHAN22 | CHAN15 | CHAN0 | CHAN16 | CHAN15 | CHAN-CLK | 2012, XESS Corp. Some rights reserved. | Licensed under a Creative Commons | Attribution-Share-Alike Unported License. | See creativecommons.org/licenses/by-sa/3.0/